# Altium schematic sheet Voltage Regulation.SchDoc
size A4; SheetNumber: 4; SheetTotal: 4
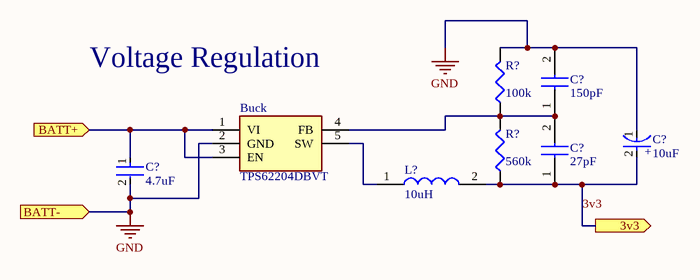
[diagram p0: Voltage Regulation.SchDoc]

## Parts
(Parts that share a designator on the sheet are numbered #1, #2 ... from top to bottom, then left to right.)
Buck  TPS62204DBVT  [SOT95P280X145-5N]
C?#1  150pF  [CAPC1608X90N]
C?#2  4.7uF  [FP-1206-L_3_2_0_2-W_1_6_0-IPC_B]
C?#3  10uF  [FP-TAJS-MFG]
C?#4  27pF  [C0603]
L?  10uH  [AISC1008F100GT]
R?#1  value 100k  [J1-0603]  (hidden comment: Res3)
R?#2  value 560k  [J1-0603]  (hidden comment: Res3)

## Ports
3v3 (out), BATT+ (in), BATT- (in)

## Nets
GND: Buck.2(GND) C?#1.2 C?#2.2 C?#3.1(C) R?#1.2 ; port BATT-
3v3: C?#3.2(A) C?#4.1 L?.2 R?#2.1 ; port 3v3
BATT+: Buck.1(VI) Buck.3(EN) C?#2.1 ; port BATT+
NetBuck_4: Buck.4(FB) C?#1.1 C?#4.2 R?#1.1 R?#2.2
NetBuck_5: Buck.5(SW) L?.1

## Notes on the sheet
- Voltage Regulation
- (in symbol CMP-04424-000459-1) +

## Library data of the parts
Buck = TPS62204DBVT: Integrated Circuit; Manufacturer_Name: Texas Instruments; Datasheet Link: http://www.ti.com/lit/gpn/tps62204; Height: 1.45mm; Manufacturer_Part_Number: TPS62204DBVT; Mouser Part Number: 595-TPS62204DBVT; Mouser Price/Stock: https://www.mouser.com/Search/Refine.aspx?Keyword=595-TPS62204DBVT; Arrow Part Number: TPS62204DBVT; Arrow Price/Stock: https://www.arrow.com/en/products/tps62204dbvt/texas-instruments
C?#1 = CL10C151JB8NNNC: Capacitor, CL10C151JB8NNNC, 150pF; Manufacturer_Name: Samsung Electro-Mechanics; Datasheet Link: https://datasheet.datasheetarchive.com/originals/dk/DKDS-19/373912.pdf; Height: 0.9mm; Manufacturer_Part_Number: CL10C151JB8NNNC; Mouser Part Number: 187-CL10C151JB8NNNC; Mouser Price/Stock: https://www.mouser.co.uk/ProductDetail/Samsung-Electro-Mechanics/CL10C151JB8NNNC?qs=349EhDEZ59rP%2F9hZgT8P9g%3D%3D; Arrow Part Number: CL10C151JB8NNNC; Arrow Price/Stock: https://www.arrow.com/en/products/cl10c151jb8nnnc/samsung-electro-mechanics
C?#2 = CMP-04427-012562-1: General Purpose Ceramic Capacitor, 1206, 4.7uF, 20%, X5R, 15%, 16V, 1206YD475MAT2A; Dissipation Factor: 5%; Tolerance: 20%; Length: 3.2mm; Min Operating Temperature: -55°C; Width: 0.063inch; Capacitance: 4.7uF; Dielectric: X5R; Case Code (Imperial): 1206; Termination: SMD/SMT; Package Quantity: 1; Depth: 1.6mm; Height: 0.07mm; Voltage Rating: 16V; Mount: Surface Mount; Lead Free: Lead Free; Construction: Flat; Case/Package: 1206; Max Operating Temperature: 85°C; Contact Plating: Tin; Voltage Rating (DC): 16V; Series: -; Case Code (Metric): 3216; RoHS Compliant: Yes; Thickness: 0.07inch; Packaging: Tape and Reel; Number of Pins: 2; Radiation Hardening: No
C?#3 = CMP-04424-000459-1: 10uF 2.5V  ±10% 8Ω 1206  SMD Tantalum Capacitor, TAJS106K002RNJ; Dissipation Factor: 6%; ESR (Equivalent Series Resistance): 8R; Lead Diameter: 1.2mm; Leakage Current: 500nA; Dielectric Material: Tantalum; Voltage Rating (DC): 2.5V; Weight: 0.000571oz; Tolerance: 10%; REACH SVHC: No SVHC; RoHS Compliant: Yes; Case Code (Metric): 3216; Min Operating Temperature: -55°C; Construction: Flat; Voltage Rating: 2.5V; Height: 1.2mm; Max Operating Temperature: 125°C; Case/Package: 1206; Packaging: Tape and Reel; Width: 1.6mm; Radiation Hardening: No; Mount: Surface Mount; Lead Free: Lead Free; Series: TAJ; Termination: SMD/SMT; Lead Pitch: 1.1mm; Depth: 1.6mm; Capacitance: 10uF; Length: 3.2mm; Number of Pins: 2; Voltage: 2.5V; Case Code (Imperial): 1206
C?#4 = C0603C270J5GAC7411: Capacitor, C0603C270J5GAC7411, 27pF; Manufacturer_Name: KEMET; Datasheet Link: https://content.kemet.com/datasheets/KEM_C1003_C0G_SMD.pdf; Height: 0.87mm; Manufacturer_Part_Number: C0603C270J5GAC7411
L? = AISC-1008F-100G-T: Inductor, AISC-1008F-100G-T; Manufacturer_Name: ABRACON; Datasheet Link: https://www.mouser.com/datasheet/2/3/AISC-1008(F)-27775.pdf; Height: 2.29mm; Manufacturer_Part_Number: AISC-1008F-100G-T; Mouser Part Number: 815-AISC1008F100GT; Mouser Price/Stock: https://www.mouser.com/Search/Refine.aspx?Keyword=815-AISC1008F100GT; Arrow Part Number: AISC-1008F-100G-T; Arrow Price/Stock: https://www.arrow.com/en/products/aisc-1008f-100g-t/abracon
R?#1 R?#2 = Res3: Resistor; Published: 8-Jun-2000; LatestRevisionDate: 29-May-2009; LatestRevisionNote: IPC-7351 Footprint Added.; PackageReference: J1-0603; Publisher: Altium Limited; PackageDescription: Chip Resistor